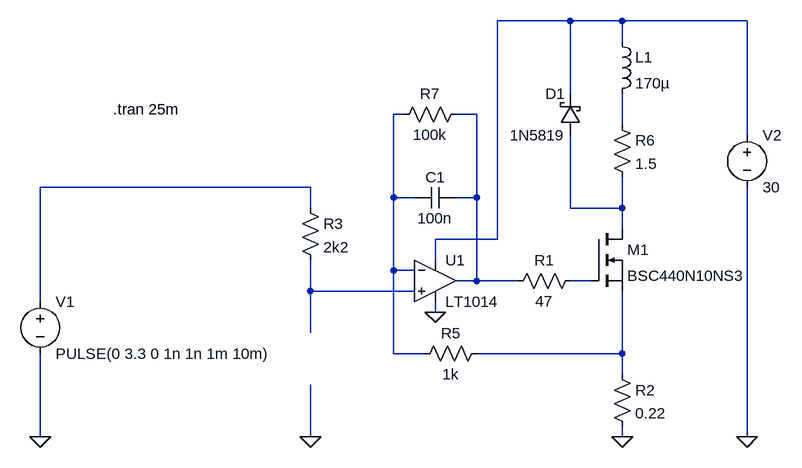
[diagram p0: schematic ksq.asc]
ksq.asc, the LTspice schematic file:
Version 4
SHEET 1 880 680
WIRE 368 -208 256 -208
WIRE 448 -208 368 -208
WIRE 640 -208 448 -208
WIRE 448 -176 448 -208
WIRE 368 -96 368 -208
WIRE 112 -64 96 -64
WIRE 224 -64 192 -64
WIRE 448 -48 448 -96
WIRE 640 -32 640 -208
WIRE -32 48 -448 48
WIRE 96 64 96 -64
WIRE 128 64 96 64
WIRE 224 64 224 -64
WIRE 224 64 192 64
WIRE -32 80 -32 48
WIRE 368 80 368 -32
WIRE 448 80 448 32
WIRE 448 80 368 80
WIRE 448 112 448 80
WIRE 256 128 256 -208
WIRE 256 128 160 128
WIRE 160 160 160 128
WIRE 96 176 96 64
WIRE 128 176 96 176
WIRE 224 192 224 64
WIRE 224 192 192 192
WIRE 288 192 224 192
WIRE 400 192 368 192
WIRE -32 208 -32 160
WIRE 128 208 -32 208
WIRE -448 224 -448 48
WIRE 160 240 160 224
WIRE -32 272 -32 208
WIRE 96 304 96 176
WIRE 144 304 96 304
WIRE 448 304 448 208
WIRE 448 304 224 304
WIRE 448 336 448 304
WIRE -448 432 -448 304
WIRE -32 432 -32 352
WIRE 448 432 448 416
WIRE 640 432 640 48
FLAG 448 432 0
FLAG -32 432 0
FLAG -448 432 0
FLAG 160 240 0
FLAG 640 432 0
SYMBOL Opamps\\LT1014 160 128 R0
SYMATTR InstName U1
SYMBOL cap 192 48 R90
WINDOW 0 0 32 VBottom 2
WINDOW 3 32 32 VTop 2
SYMATTR InstName C1
SYMATTR Value 100n
SYMBOL res 384 176 R90
WINDOW 0 0 56 VBottom 2
WINDOW 3 32 56 VTop 2
SYMATTR InstName R1
SYMATTR Value 47
SYMBOL nmos 400 112 R0
SYMATTR InstName M1
SYMATTR Value BSC440N10NS3
SYMBOL res 432 320 R0
SYMATTR InstName R2
SYMATTR Value 0.22
SYMBOL res -48 64 R0
SYMATTR InstName R3
SYMATTR Value 2k2
SYMBOL voltage -448 208 R0
WINDOW 123 0 0 Left 2
WINDOW 39 0 0 Left 2
SYMATTR InstName V1
SYMATTR Value PULSE(0 3.3 0 1n 1n 1m 10m)
SYMBOL res 240 288 R90
WINDOW 0 0 56 VBottom 2
WINDOW 3 32 56 VTop 2
SYMATTR InstName R5
SYMATTR Value 1k
SYMBOL res 432 -64 R0
SYMATTR InstName R6
SYMATTR Value 1.5
SYMBOL ind 432 -192 R0
SYMATTR InstName L1
SYMATTR Value 170µ
SYMBOL schottky 384 -32 R180
WINDOW 0 24 64 Left 2
WINDOW 3 24 0 Left 2
SYMATTR InstName D1
SYMATTR Value 1N5819
SYMATTR Description Diode
SYMATTR Type diode
SYMBOL voltage 640 -48 R0
WINDOW 123 0 0 Left 2
WINDOW 39 0 0 Left 2
SYMATTR InstName V2
SYMATTR Value 30
SYMBOL res 208 -80 R90
WINDOW 0 0 56 VBottom 2
WINDOW 3 32 56 VTop 2
SYMATTR InstName R7
SYMATTR Value 100k
TEXT -336 -72 Left 2 !.tran 25m

The netlist it stands for:
* ksq.asc
XU1 N008 N002 N001 0 N003 LT1014  ; pins In+ In- V+ V- OUT
C1 N003 N002 100n
R1 N007 N003 47
M1 N006 N007 N009 N009 BSC440N10NS3
R2 N009 0 0.22
R3 N005 N008 2k2
V1 N005 0 PULSE(0 3.3 0 1n 1n 1m 10m)
R5 N009 N002 1k
R6 N004 N006 1.5
L1 N001 N004 170µ
D1 N006 N001 1N5819
V2 N001 0 30
R7 N003 N002 100k
.model D D
.lib standard.dio
.model NMOS NMOS
.model PMOS PMOS
.lib standard.mos
.tran 25m
.backanno
.end